# EAGLE design CEM3310 VADSR v2.2 (EAGLE 9.6.2)
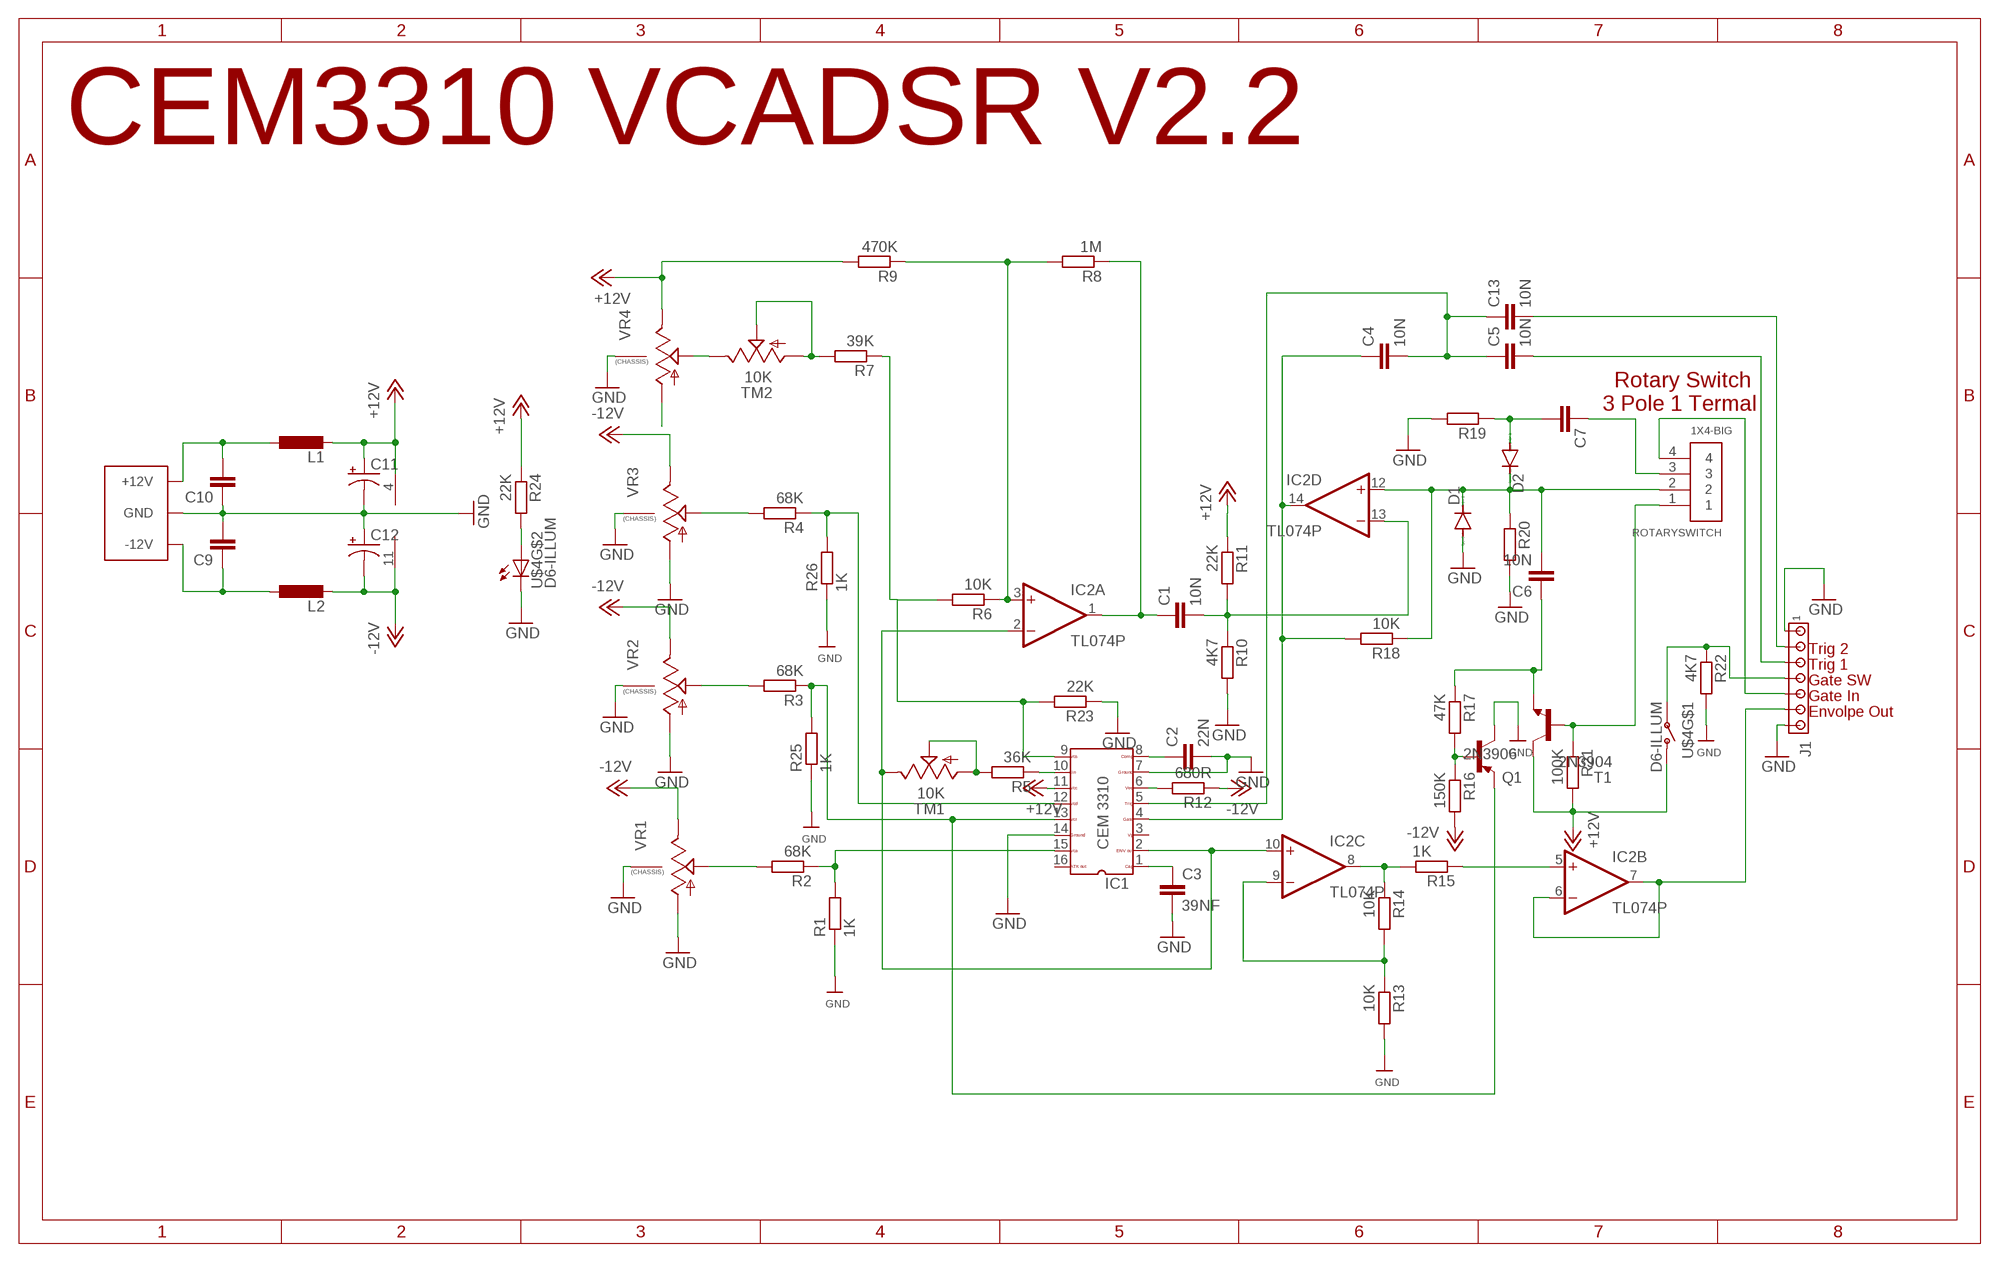
[diagram p0: schematic, sheet 1]

## Parts
C1  10N  C-EU050-025X075  [C050-025X075]
C2  22N  C-EU050-025X075  [C050-025X075]
C3  39NF  C-EU050-025X075  [C050-025X075]
C4  10N  C-EU050-025X075  [C050-025X075]
C5  10N  C-EU050-025X075  [C050-025X075]
C6  10N  C-EU050-025X075  [C050-025X075]
C7  C-EU050-025X075  [C050-025X075]
C8  EURO_POWER_LOCKSKINNY  [EURO_POWER_HEADER]
C9  C-EU050-025X075  [C050-025X075]
C10  C-EU050-025X075  [C050-025X075]
C11  CAPACITOR-PE2.5-6  [E2,5-6]
C12  CAPACITOR-PE2.5-6  [E2,5-6]
C13  10N  C-EU050-025X075  [C050-025X075]
D1  OA95  1N4148DO35-7  [DO35-7]
D2  1N4148DO35-7  [DO35-7]
IC1  CEM3310  [DIL16]
IC2  TL074P  [DIL14]
J1  MTA07-100  [10X07MTA]
L1  L-EU0207/7  [0207/7]
L2  L-EU0207/7  [0207/7]
Q1  2N3906  [TO92]
R1  1K  R-EU_0207/7  [0207/7]
R2  68K  R-EU_0207/7  [0207/7]
R3  68K  R-EU_0207/7  [0207/7]
R4  68K  R-EU_0207/7  [0207/7]
R5  36K  R-EU_0207/7  [0207/7]
R6  10K  R-EU_0207/7  [0207/7]
R7  39K  R-EU_0207/7  [0207/7]
R8  1M  R-EU_0207/7  [0207/7]
R9  470K  R-EU_0207/7  [0207/7]
R10  4K7  R-EU_0207/7  [0207/7]
R11  22K  R-EU_0207/7  [0207/7]
R12  680R  R-EU_0207/7  [0207/7]
R13  10K  R-EU_0207/7  [0207/7]
R14  10K  R-EU_0207/7  [0207/7]
R15  1K  R-EU_0207/7  [0207/7]
R16  150K  R-EU_0207/7  [0207/7]
R17  47K  R-EU_0207/7  [0207/7]
R18  10K  R-EU_0207/7  [0207/7]
R19  R-EU_0207/7  [0207/7]
R20  R-EU_0207/7  [0207/7]
R21  100K  R-EU_0207/7  [0207/7]
R22  4K7  R-EU_0207/7  [0207/7]
R23  22K  R-EU_0207/7  [0207/7]
R24  22K  R-EU_0207/7  [0207/7]
R25  1K  R-EU_0207/7  [0207/7]
R26  1K  R-EU_0207/7  [0207/7]
ROTARYSWITCH  1X4-BIG  [1X04-BIG]
T1  2N3904  [TO92]
TM1  10K  TRIM  [6MM]
TM2  10K  TRIM  [6MM]
U$4  D6-ILLUM  [D6_PUSH_SWITCH_ILLUM]
VR1  9MM_SNAP-IN_POT_CHASSIS  [9MM_SNAP-IN_POT]
VR2  9MM_SNAP-IN_POT_CHASSIS  [9MM_SNAP-IN_POT]
VR3  9MM_SNAP-IN_POT_CHASSIS  [9MM_SNAP-IN_POT]
VR4  9MM_SNAP-IN_POT_CHASSIS  [9MM_SNAP-IN_POT]

## Nets
+12V: C11.+ IC1.11 IC2.4(P:V+) L1.2 R9.2 R11.1 R21.2 R24.1 T1.1(C) U$4.P$1(O) U$4.P$2(O) VR4.3(E)
-12V: C12.- IC2.11(P:V-) L2.2 R12.1 R16.2 VR1.3(E) VR2.3(E) VR3.3(E)
GND: C2.2 C3.2 C8.3(GND) C8.4(GND) C8.5(GND) C8.6(GND) C8.7(GND) C8.8(GND) C9.2 C10.1 C11.- C12.+ D1.A IC1.7 IC1.14 J1.1 J1.7 Q1.1(C) R1.1 R10.2 R13.2 R19.2 R20.2 R22.2 R23.1 R25.1 R26.1 U$4.LED-(C) VR1.1(A) VR1.CHASSIS1 VR1.CHASSIS2 VR2.1(A) VR2.CHASSIS1 VR2.CHASSIS2 VR3.1(A) VR3.CHASSIS1 VR3.CHASSIS2 VR4.CHASSIS1 VR4.CHASSIS2
GND1: VR4.1(A)
N$1: C3.1 IC1.1
N$2: IC1.15 R1.2 R2.1
N$3: R2.2 VR1.2(S)
N$4: IC2.5(B:+IN) R15.1
N$5: IC1.13 Q1.3(E) R3.1 R25.2
N$6: R3.2 VR2.2(S)
N$7: IC2.6(B:-IN) IC2.7(B:OUT) J1.6
N$8: IC1.12 R4.1 R26.2
N$9: R4.2 VR3.2(S)
N$10: C7.1 ROTARYSWITCH.3
N$11: R5.2 TM1.A TM1.S
N$12: IC1.10 R5.1
N$13: IC1.2 IC2.2(A:-IN) IC2.10(C:+IN) TM1.E
N$14: IC1.9 R6.2 R7.1 R23.2
N$15: C1.1 IC2.1(A:OUT) R8.1
N$16: R7.2 TM2.A TM2.S
N$17: IC2.3(A:+IN) R6.1 R8.2 R9.1
N$18: TM2.E VR4.2(S)
N$19: C1.2 IC2.13(D:-IN) R10.1 R11.2
N$20: J1.5 ROTARYSWITCH.4
N$21: C13.2 J1.2
N$23: IC1.6 R12.2
N$24: C5.2 J1.3
N$25: C2.1 IC1.8
N$26: IC2.9(C:-IN) R13.1 R14.2
N$27: IC2.8(C:OUT) R14.1 R15.2
N$28: C6.1 R17.1 T1.3(E)
N$29: Q1.2(B) R16.1 R17.2
N$30: C6.2 D1.C D2.C IC2.12(D:+IN) R18.1 R20.1 ROTARYSWITCH.2
N$31: C4.1 IC1.4 IC2.14(D:OUT) R18.2
N$33: C4.2 C5.1 C13.1 IC1.5
N$34: C7.2 D2.A R19.1
N$36: R21.1 ROTARYSWITCH.1 T1.2(B)
N$40: J1.4 R22.1 U$4.P$3(P) U$4.P$4(P)
N$41: R24.2 U$4.LED+(A)
N$42: C8.9(+12V) C8.10(+12V) C10.2 L1.1
N$45: C8.1(-12V) C8.2(-12V) C9.1 L2.1
Unconnected: IC1.3 IC1.16

## Notes on the sheet
- CEM3310 VCADSR V2.2
- Rotary Switch
  3 Pole 1 Termal
- Trig 2
- Trig 1
- Gate SW
- Gate In
- Envolpe Out

## Library data of the parts
C1-C7 C9 C10 C13 = hexxxxrcl:C-EU: CAPACITOR, European symbol; SPICEPREFIX: C
C8 = MusicThingModular:EURO_POWER_LOCK
C11 C12 = BeagleBone_Blue_R3:CAPACITOR-P: POLARIZED CAPACITOR, American symbol
D1 D2 = diode:1N4148: DIODE high speed (Philips)
IC1 = CEM:CEM3310: CEM 3310 VCEG
IC2 = linear:TL074: OP AMP
J1 = con-amp:MTA07-100: AMP connector
L1 L2 = hexxxxrcl:L-EU: INDUCTOR, European symbol; SPICEPREFIX: L
Q1 = transistor-pnp:2N3906: PNP Transistor
R1-R26 = hexxxxrcl:R-EU_: RESISTOR, European symbol; SPICEPREFIX: R
ROTARYSWITCH = adafruit:1X4: 4-pin connector
T1 = transistor:2N3904: NPN TRANSISTOR
TM1 TM2 = adafruit:TRIM
U$4 = MusicThingModular:D6-ILLUM
VR1-VR4 = MusicThingModular:9MM_SNAP-IN_POT_CHASSIS: 9mm vertical snap-in pot, Alpha / Panasonic style, with a connection to the metal chassis for grounding

## Net classes
0 default: width 0.406 mm

## Board
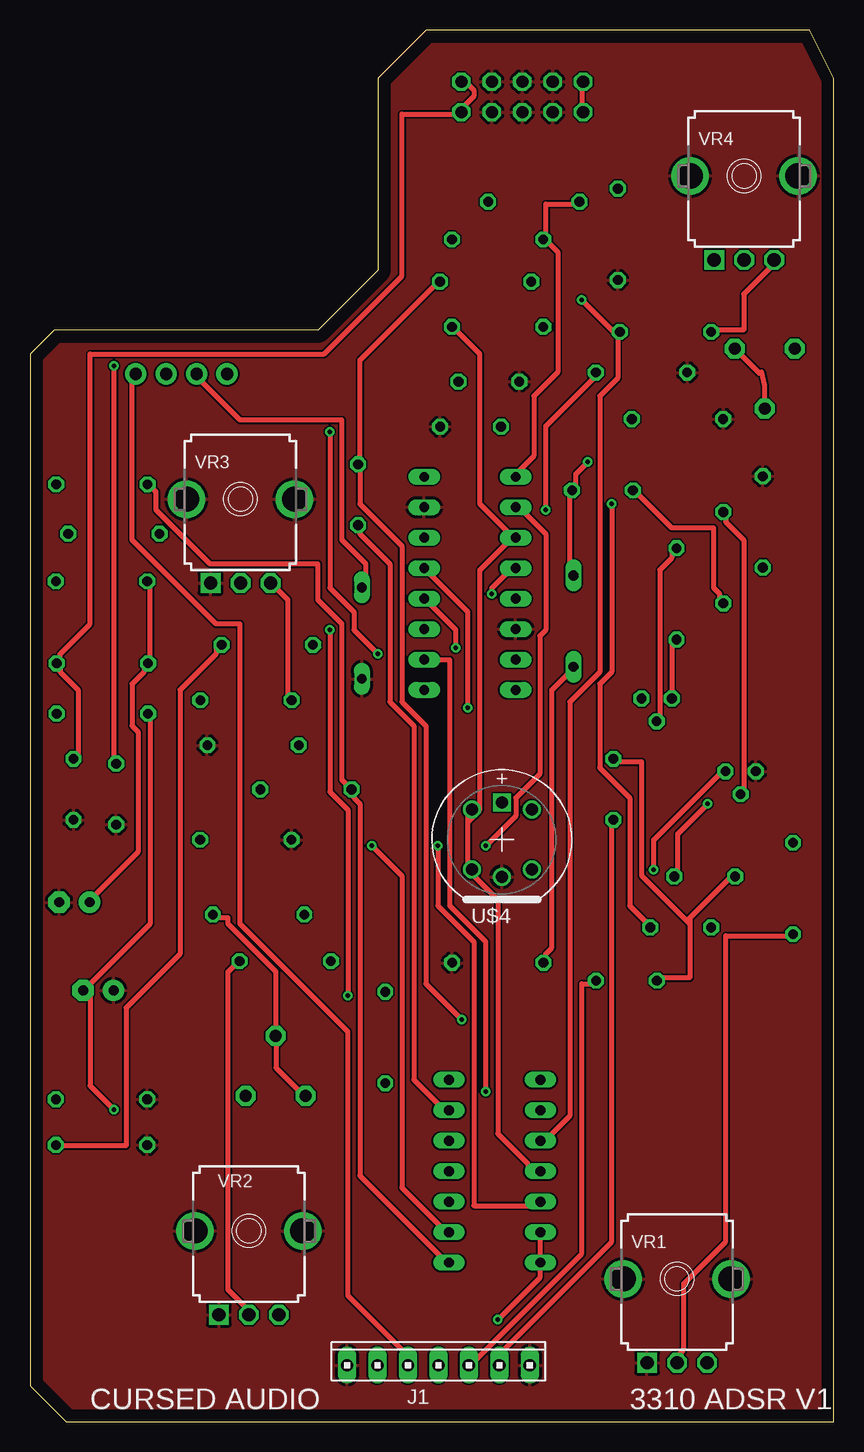
[diagram p1: board, top side]
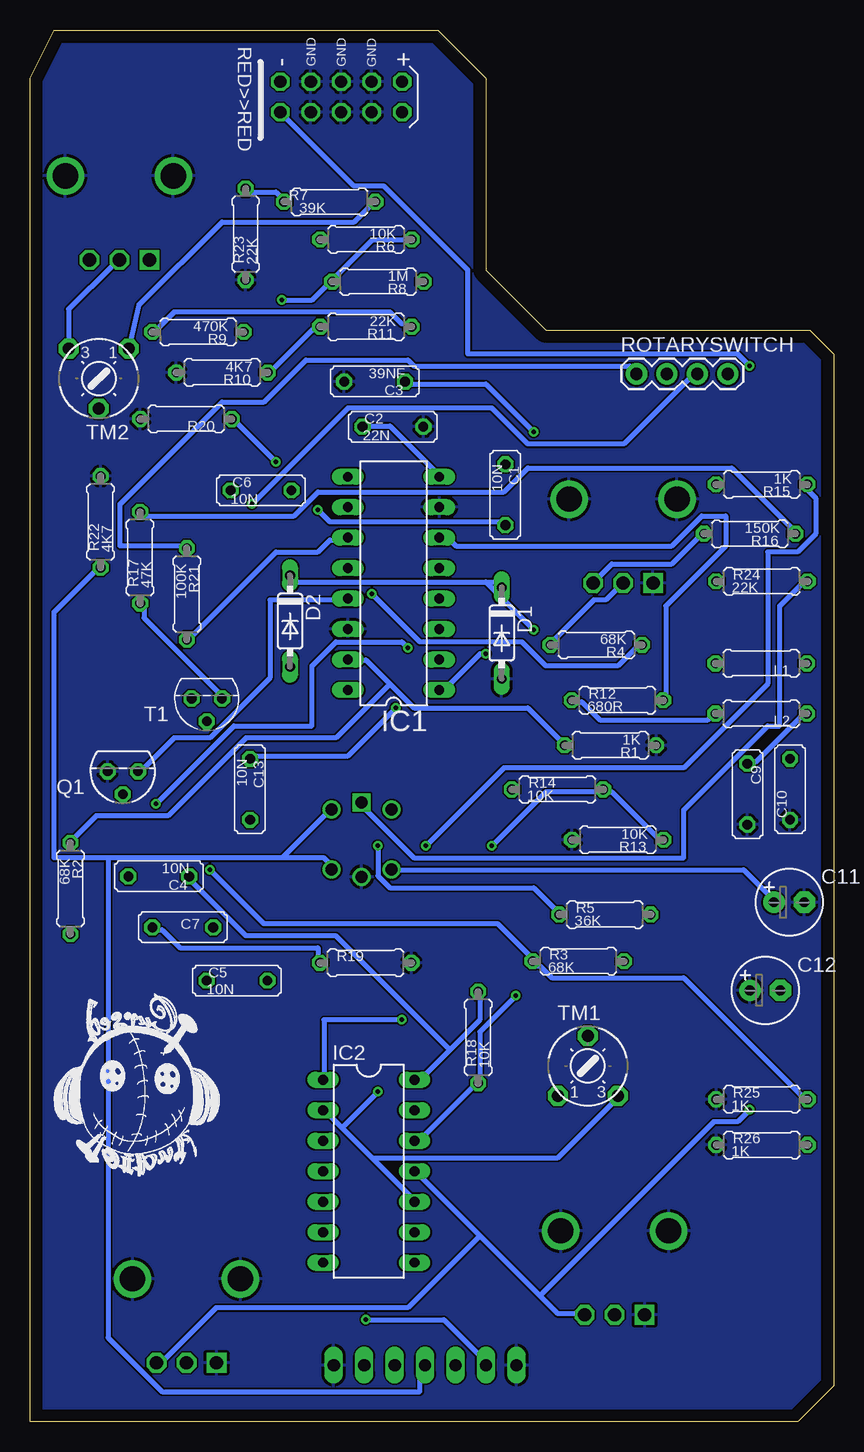
[diagram p2: board, bottom side, seen from below]

Size 67 x 116 mm. Coordinates in mm from the lower left corner, seen from the top.
Outline: 3,0 67,0 67,112 65,116 33,116 29,112 29,96 24,91 2,91 0,89 0,3 3,0
Copper layers (1*16): Top 0.035mm / dielectric 1.5mm / Bottom 0.035mm
Design rules "default": minimum track width 6mil, minimum drill 0.35mm, track to track 6mil, track to pad 6mil, pad to pad 6mil, via to via 6mil, smd to smd 6mil, copper to edge 40mil, drill to drill 6mil, minimum pad ring 10mil, minimum via ring 8mil, stop-mask expansion 4mil, vias tented up to drill 0mil, thermal gap 10mil

### Footprints (pad centres in the part's own frame; a part is rotated, then mirrored left to right if it is on the bottom)
C050-025X075 = drill 0.813 octagon: 1 -2.54,0; 2 2.54,0
EURO_POWER_HEADER = drill 1.016 octagon: 1 -5.08,-1.27; 2 -5.08,1.27; 3 -2.54,-1.27; 4 -2.54,1.27; 5 0,-1.27; 6 0,1.27; 7 2.54,-1.27; 8 2.54,1.27; 9 5.08,-1.27; 10 5.08,1.27
E2,5-6 = drill 0.813 pad 1.778: + -1.27,0 | drill 0.813 pad 1.778 octagon: - 1.27,0
DO35-7 = drill 0.813 long: A 3.81,0; C -3.81,0
DIL16 = drill 0.813 long: 1 -8.89,-3.81; 2 -6.35,-3.81; 3 -3.81,-3.81; 4 -1.27,-3.81; 5 1.27,-3.81; 6 3.81,-3.81; 7 6.35,-3.81; 8 8.89,-3.81; 9 8.89,3.81; 10 6.35,3.81; 11 3.81,3.81; 12 1.27,3.81; 13 -1.27,3.81; 14 -3.81,3.81; 15 -6.35,3.81; 16 -8.89,3.81
DIL14 = drill 0.813 long: 1 -7.62,-3.81; 2 -5.08,-3.81; 3 -2.54,-3.81; 4 0,-3.81; 5 2.54,-3.81; 6 5.08,-3.81; 7 7.62,-3.81; 8 7.62,3.81; 9 5.08,3.81; 10 2.54,3.81; 11 0,3.81; 12 -2.54,3.81; 13 -5.08,3.81; 14 -7.62,3.81
10X07MTA = drill 1.016 long: 1 7.62,0; 2 5.08,0; 3 2.54,0; 4 0,0; 5 -2.54,0; 6 -5.08,0; 7 -7.62,0
0207/7 = drill 0.813 octagon: 1 -3.81,0; 2 3.81,0
TO92 = drill 0.813 octagon: 1 1.27,0; 2 0,1.905; 3 -1.27,0
1X04-BIG = drill 1.016 pad 1.778: 1 0,0; 2 2.54,0; 3 5.08,0; 4 7.62,0
6MM = drill 1 pad 1.676 octagon: A -2.5,-2.5; E 2.5,-2.5; S 0,2.5
D6_PUSH_SWITCH_ILLUM = drill 1 square: LED+ 3.1,0 | drill 1: LED- -3.1,0; P$1 -2.5,2.5; P$2 2.5,2.5; P$3 2.5,-2.5; P$4 -2.5,-2.5
9MM_SNAP-IN_POT = drill 1.1 square: 1 -2.5,-7 | drill 1.1 octagon: 2 0,-7; 3 2.5,-7 | drill 2.1 pad 2.794: CHASSIS1 -4.5,0; CHASSIS2 4.5,0

### Placement (x,y rotation side)
C1  27.36,77.26 270 bottom
C2  36.74,82.93 0 bottom
C3  38.26,86.69 180 bottom
C4  56.26,45.44 180 bottom
C5  49.74,36.75 0 bottom
C6  47.74,77.62 0 bottom
C7  54.26,41.19 180 bottom
C8  41.05,110.42 0 bottom
C9  7.18,52.3 270 bottom
C10  3.63,52.7 90 bottom
C11  3.7,43.29 0 bottom
C12  5.7,35.94 0 bottom
C13  48.65,52.7 270 bottom
D1  27.67,65.72 270 bottom
D2  45.32,66.72 270 bottom
IC1  36.68,69.87 90 bottom
IC2  38.75,20.86 270 bottom
J1  34.05,4.7 0 top
L1  6.03,63.2 180 bottom
L2  6.03,59.01 180 bottom
Q1  59.26,54.2 180 bottom
R1  18.6,56.37 180 bottom
R2  63.63,44.44 270 bottom
R3  21.28,38.37 0 bottom
R4  19.78,64.74 180 bottom
R5  19.06,42.26 0 bottom
R6  38.99,98.54 180 bottom
R7  42.01,101.68 0 bottom
R8  37.99,95.02 180 bottom
R9  52.99,90.83 180 bottom
R10  50.99,87.45 180 bottom
R11  38.99,91.26 180 bottom
R12  18.01,60.12 0 bottom
R13  17.99,48.5 180 bottom
R14  23.01,52.69 0 bottom
R15  5.99,78.12 180 bottom
R16  6.99,74.01 180 bottom
R17  57.82,72.01 90 bottom
R18  29.63,32.01 90 bottom
R19  39.01,38.24 0 bottom
R20  53.99,83.57 180 bottom
R21  53.92,68.99 270 bottom
R22  61.11,74.99 90 bottom
R23  49.02,98.97 90 bottom
R24  5.97,70.04 0 bottom
R25  5.97,26.86 0 bottom
R26  5.97,23.05 0 bottom
ROTARYSWITCH  16.43,87.33 0 bottom
T1  52.26,60.27 180 bottom
TM1  20.49,29.64 0 bottom
TM2  61.26,86.94 180 bottom
U$4  39.34,48.51 90 top
U$8  [CA]  62.32,25.33 0 top
VR1  53.95,11.89 0 top
VR2  18.25,15.89 0 top
VR3  17.55,76.89 0 top
VR4  59.55,103.84 0 top

### Tracks (layer width: path | path; a pad name or v marks a point on that pad's centre or on a via)
+12V
  Top 0.406: R9.2 57,91 59.5,91 59.5,94 62,96.5 VR4.3 | T1.1 53.5,60.5 53.5,65 R21.2 | R11.1 35.5,91 37.5,89 37.5,76.5 40,74 IC1.11 40,73.5 37.5,71 37.5,51 36.5,50 | R24.1 10,70 10,63.5 L1.2 9.5,63 9.5,62.5 8.5,61.5 8.5,58 9,57.5 9,47.5 5,43.5 C11.+ | IC2.4 42.5,21 41.5,21 41.5,21.5 39,24 39,43.5 37,45.5 37,46 U$4.P$1 36.5,46.5 36.5,50 | 36.5,50 36.5,51 U$4.P$2
  Bottom 0.406: IC1.11 40.5,73.5 42,73.5 43,72.5 46.5,72.5 53.5,65.5 R21.2 | R9.2 56.5,91 55,92.5 37,92.5 36,91.5 35.5,91.5 R11.1 | C11.+ 5,43.5 7.5,46 36.5,46 U$4.P$1
-12V  (via drill 0.35)
  Top 0.406: 5,36.5 10,41.5 10,59 L2.2 | 5,36.5 4.5,36 C12.- 5,36.5 | VR3.3 20.5,69.5 21.5,68.5 21.5,60.5 R12.1 | v7,26 5,28 5,36.5
  Bottom 0.406: 24.5,10.5 23,9 21,9 VR2.3 | 24.5,10.5 29.5,15.5 | 29.5,15.5 34.5,20.5 IC2.11 | 29.5,15.5 35.5,9.5 51.5,9.5 56,5 VR1.3 | R16.2 11,74 13.5,71.5 18.5,71.5 20,70 VR3.3 | L2.2 10,59 10.5,58.5 19.5,58.5 21,60 21.5,60 R12.1 | 24.5,10.5 10,25 8,25 v7,26
GND
  pour Top: 0,89 2,91 23,91 29,97 29,112 33,116 65,116 67,114 67,0 3,0 0,3
  pour Bottom: 0,89 2,91 24,91 28,95 29,95 29,113 32,116 65,116 67,114 67,0 3,0 0,3
N$1  (via drill 0.35)
  Top 0.406: v29,64 27,66 27,67.5 25,69.5 v25,82.5
  Bottom 0.406: v29,64 29.5,64 32.5,61 IC1.1 | v25,82.5 29,86.5 35.5,86.5 C3.1
N$2
  Bottom 0.406: 37,61.5 39,63.5 40,63.5 IC1.15 | 37,61.5 35,59.5 25.5,59.5 22.5,56.5 R1.2 | 37,61.5 41.5,57 49,57 55.5,50.5 61.5,50.5 63.5,48.5 R2.1
N$3
  Top 0.406: R2.2 63.5,40.5 58,40.5 58,15 54.5,11.5 54.5,6 54,5.5 54,5 VR1.2
N$4  (via drill 0.35)
  Top 0.406: v34,48 34,43 37,40 37,18 42.5,18 IC2.5
  Bottom 0.406: v34,48 27.5,54.5 12.5,54.5 5.5,61.5 5.5,72.5 3,72.5 1.5,74 1.5,77 2.5,78 R15.1
N$5  (via drill 0.35)
  Top 0.406: v52,46 52,48.5 57.5,54 Q1.3
  Bottom 0.406: Q1.3 57.5,54.5 55,57 52,57 47,62 47,68.5 40.5,68.5 IC1.13 | R25.2 2.5,27 12.5,37 23.5,37 24.5,38 25,38 R3.1 25,38.5 28,41.5 47.5,41.5 v52,46
N$6
  Top 0.406: R3.2 17,38 16.5,37.5 16.5,11 18,9.5 18,9 VR2.2
N$7  (via drill 0.35)
  Top 0.406: IC2.6 42.5,15.5 42.5,13.5 IC2.7 42.5,13 42.5,12 v39,8.5
  Bottom 0.406: v39,8.5 32.5,8.5 29,5 J1.6
N$8  (via drill 0.35)
  Top 0.406: R26.2 2.5,23 8,23 8,34.5 12.5,39 12.5,61 15.5,64 15.5,64.5 R4.1 | v38.5,69 38.5,69.5 40,71 IC1.12
  Bottom 0.406: v38.5,69 34.5,65 26,65 24,63 18,63 16.5,64.5 16,64.5 R4.1
N$9
  Bottom 0.406: R4.2 23.5,65 20,68.5 19,68.5 18,69.5 VR3.2
N$10  (via drill 0.35)
  Top 0.406: v48.5,76.5 48.5,62.5 47.5,61.5 47.5,54.5 50,52 50,43 51.5,41.5 C7.1
  Bottom 0.406: v48.5,76.5 40.5,84.5 28.5,84.5 25.5,81.5 17.5,81.5 12,87 11.5,87 ROTARYSWITCH.3
N$11
  Top 0.406: R5.2 15.5,42 16.5,42 16.5,41.5 20.5,37.5 20.5,32.5 TM1.S 20.5,32 20.5,29.5 22.5,27.5 TM1.A
N$12  (via drill 0.35)
  Top 0.406: v38,48 40.5,50.5 40.5,52 42.5,54 42.5,65.5 43,66 43,74 40.5,76.5 IC1.10
  Bottom 0.406: v38,48 38,45.5 37,44.5 25,44.5 23,42.5 R5.1
N$13  (via drill 0.35)
  Top 0.406: v38,27.5 38,40 35,43 35,63.5 33,63.5 IC1.2
  Bottom 0.406: 41,24.5 42,25.5 42.5,25.5 IC2.2 | 41,24.5 38.5,22 | 38.5,22 35,18.5 IC2.10 | 41,24.5 v38,27.5 | 38.5,22 23,22 18,27 TM1.E
N$14
  Top 0.406: IC1.9 40.5,79 42,80.5 42,85.5 44,87.5 44,97.5 43,98.5 R6.2 43,99 43,101.5 45.5,101.5 R7.1
  Bottom 0.406: R7.1 46,102 46.5,102.5 49,102.5 R23.2
N$15  (via drill 0.35)
  Top 0.406: v36,33.5 33,36.5 33,58 31,60 31,73 27.5,76.5 27.5,79.5 C1.1 27.5,80 27.5,88.5 34,95 R8.1
  Bottom 0.406: v36,33.5 42.5,33.5 42.5,28.5 IC2.1
N$16
  Top 0.406: TM2.S 61.26,86.37 61,87.5 60.81,87.39 TM2.A
  Bottom 0.406: R7.2 38.5,101.5 40,100 51,100 57.92,93.08 TM2.A
N$17  (via drill 0.35)
  Top 0.406: 49,90.5 49,87 47.5,85.5 47.5,62.5 45,60 45,25.5 43,23.5 IC2.3 | 49,90.5 v46,93.5 | 49,90.5 R9.1
  Bottom 0.406: R6.1 35.5,98.5 38.5,98.5 41.5,95.5 R8.2 42,95 43.5,93.5 v46,93.5
N$18
  Bottom 0.406: VR4.2 60,96.5 63.8,92.7 63.76,92.69 TM2.E
N$19  (via drill 0.35)
  Top 0.406: IC2.13 34.5,26 32,28.5 32,58 30,60 30,71.5 27.5,74 27.5,74.5 C1.2 | v43,76 43,83 47,87 R10.1
  Bottom 0.406: R10.1 47,87.5 43.5,91 43,91 R11.2 | v43,76 42,75 27.5,75 C1.2
N$20
  Top 0.406: 32,5 J1.5 31.5,5 31.5,5.5 26.5,10.5 26.5,32.5 17.5,41.5 17.5,66.5 15.5,66.5 8.5,73.5 8.5,87 ROTARYSWITCH.4
N$21
  Top 0.406: C13.2 48.5,50 48.5,15 39.5,6 39.5,5 J1.2
N$23
  Bottom 0.406: R12.2 14,60.5 14,68 9,73 9,75.5 11,75.5 13.5,73 31.5,73 32,73.5 32.5,73.5 IC1.6
N$24
  Top 0.406: C5.2 47,36.5 46,36.5 46,14 37,5 J1.3
N$25
  Bottom 0.406: IC1.8 33,79 37,83 39,83 C2.1
N$26  (via drill 0.35)
  Top 0.406: v28.5,48 31,45.5 31,19.5 34.5,16 IC2.9
  Bottom 0.406: v28.5,48 24,52.5 19.5,52.5 R14.2 19,52.5 18.5,52.5 14.5,48.5 R13.1
N$27
  Top 0.406: IC2.8 34.5,13.5 27.5,20.5 27.5,51.5 27,52 27,52.5 R14.1 26.5,53 26,53.5 26,66.5 24,68.5 24,71.5 15,71.5 10.5,76 10.5,77.5 10,78 R15.2
N$28
  Top 0.406: C6.1 50.5,77.5 53.5,74.5 57,74.5 57,69.5 57.5,69 57.5,68.5 R17.1
  Bottom 0.406: T1.3 51,60.5 57.5,67 57.5,68 R17.1
N$29
  Top 0.406: Q1.2 59.5,52.5 59.5,73.5 58,75 58,75.5 R17.2
  Bottom 0.406: R16.1 3.5,74.5 8.5,79.5 25.5,79.5 27.5,77.5 43,77.5 45,75.5 57.5,75.5 R17.2
N$30  (via drill 0.35)
  Top 0.406: D2.C 45,71 45,77.5 C6.2 45.5,78 45.5,79 v46.5,80 | ROTARYSWITCH.2 14,87 17.5,83.5 26,83.5 26,73.5 28,71.5 28,70 D1.C | v26.5,35.5 26.5,51 25,52.5 v25,66
  Bottom 0.406: IC2.12 34.5,23.5 34,23.5 34,24 30,28 R18.1 29.5,28.5 29.5,32.5 v26.5,35.5 | 29,70 45,70 45.5,70.5 D2.C | 29,70 28,70 D1.C | v46.5,80 50,83.5 R20.1 | 29,70 v25,66
N$31  (via drill 0.35)
  Top 0.406: v35.5,64.5 35.5,66 33,68.5 IC1.4 | v56.5,51.5 54,49 54,45.5 C4.1
  Bottom 0.406: 32,31 29.5,33.5 29.5,35.5 R18.2 | 32,31 34.5,28.5 IC2.14 | 32,31 41.5,40.5 49,40.5 53.5,45 C4.1 | v35.5,64.5 36,65 41.5,65 43.5,63 43.5,58 50,58 v56.5,51.5
N$33  (via drill 0.35)
  Top 0.406: 55,41.5 55,42 58.5,45.5 C4.2 | 55,41.5 55,37 52.5,37 C5.1 | 55,41.5 51,45.5 51,55 49,55 C13.1 | v36.5,59.5 36.5,67.5 33,71 IC1.5
  Bottom 0.406: v36.5,59.5 40.5,55.5 48.5,55.5 C13.1
N$34
  Top 0.406: D2.A 45,62.5 43.5,61 43.5,39.5 43,39 43,38.5 R19.1
  Bottom 0.406: R19.1 43,38.5 43,39.5 54.5,39.5 56,41 56.5,41 C7.2
N$36
  Top 0.406: T1.2 52.5,58.5 52.5,71 53.5,72 53.5,72.5 R21.1
  Bottom 0.406: ROTARYSWITCH.1 16.5,87.5 17,88 35,88 35.5,88.5 44,88.5 47.5,85 51,85 59.5,76.5 59.5,73 54,73 R21.1
N$40
  Bottom 0.406: 46,47 42.5,47 42,46.5 U$4.P$4 | 46,47 60.5,47 | 60.5,47 65,47 65,67.5 61.5,71 R22.1 | 46,47 42,51 U$4.P$3 | 60.5,47 60.5,7 56,2.5 34.5,2.5 34.5,4.5 J1.4
N$41
  Bottom 0.406: R24.2 2.5,70 4.5,68 4.5,58 5.5,58 12.5,51 12.5,47 35,47 39.5,51.5 U$4.LED+
N$42
  Top 0.406: C8.10 36,112 37,111 37,110.5 36,109.5 C8.9 35.5,109 31,109 31,95.5 24.5,89 5,89 5,66.5 2.5,64 2.5,63.5 L1.1 2.5,63 2.5,62.5 4,61 4,55.5 C10.2
N$45  (via drill 0.35)
  Top 0.406: C8.1 46,109.5 46,111.5 C8.2 | v7,88 7,55 C9.1
  Bottom 0.406: L2.1 2.5,59 6.5,55 7,55 C9.1 | v7,88 8,89 30.5,89 30.5,96 37.5,103 40,103 46,109 C8.1

### Text on the board
tPlace: CURSED AUDIO | 3310 ADSR V1